# Altium schematic sheet LPCB219 - REMOTE ACCEL IF.SchDoc
size A3; Address1: Factory 10; Address2: 9-13 Dingley Avenue, Dandeong, VICTORIA 3175, AUSTRALIA; DocumentNumber: 7; Revision: 1; SheetNumber: 7; SheetTotal: 7; Lockie__PCB_SUB_ASSEMBLY: Remote Accel Interface; Lockie__PCB_ASSEMBLY: Main; Lockie__LDL: LPCB219; Lockie__PCB_DESCRIPTION: Control Node
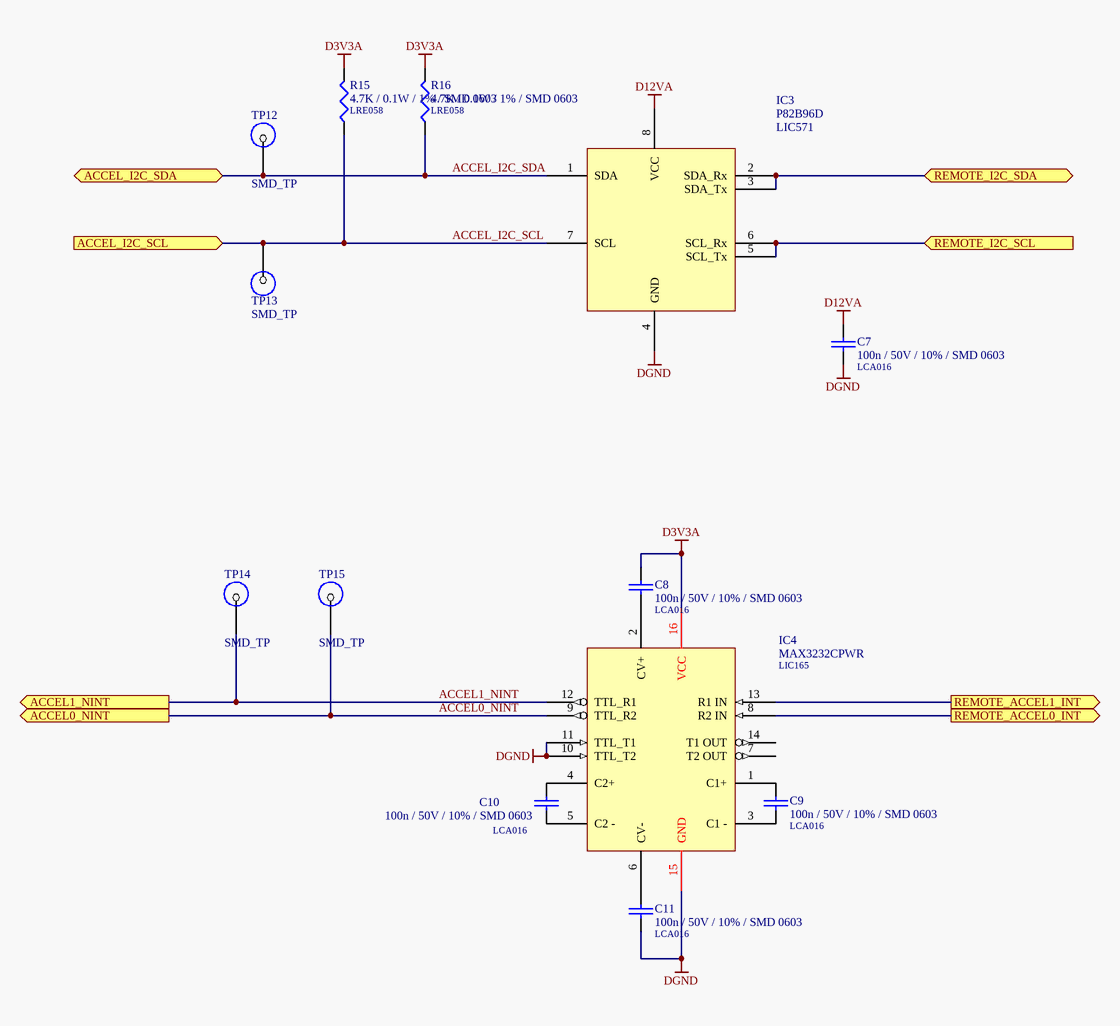
[diagram p0: LPCB219 - REMOTE ACCEL IF.SchDoc]

## Parts
C7  100n / 50V / 10% / SMD 0603  LDL_NUMBER: LCA016  [LFP011__CC1608-0603-IPC7351_B]
C8  100n / 50V / 10% / SMD 0603  LDL_NUMBER: LCA016  [LFP011__CC1608-0603-IPC7351_B]
C9  100n / 50V / 10% / SMD 0603  LDL_NUMBER: LCA016  [LFP011__CC1608-0603-IPC7351_B]
C10  100n / 50V / 10% / SMD 0603  LDL_NUMBER: LCA016  [LFP011__CC1608-0603-IPC7351_B]
C11  100n / 50V / 10% / SMD 0603  LDL_NUMBER: LCA016  [LFP011__CC1608-0603-IPC7351_B]
IC3  P82B96D  LDL_NUMBER: LIC571  [LFP097__SOIC150-8]
IC4  MAX3232CPWR  LDL_NUMBER: LIC165  [LFP049__TSSOP-16]
R15  4.7K / 0.1W / 1% / SMD 0603  LDL_NUMBER: LRE058  [LFP020__CR1608-0603-IPC7351_B]
R16  4.7K / 0.1W / 1% / SMD 0603  LDL_NUMBER: LRE058  [LFP020__CR1608-0603-IPC7351_B]
TP12  SMD_TP  [SMD-TP]  (no BOM)
TP13  SMD_TP  [SMD-TP]  (no BOM)
TP14  SMD_TP  [SMD-TP]  (no BOM)
TP15  SMD_TP  [SMD-TP]  (no BOM)

## Ports
ACCEL0_NINT (out), ACCEL1_NINT (out), ACCEL_I2C_SCL (in), ACCEL_I2C_SDA (bidir), REMOTE_ACCEL0_INT (out), REMOTE_ACCEL1_INT (out), REMOTE_I2C_SCL (in), REMOTE_I2C_SDA (bidir)

## Nets
D3V3A: C8.1 IC4.16(VCC) R15.2 R16.2
D12VA: C7.1 IC3.8(VCC)
DGND: C7.2 C11.2 IC3.4(GND) IC4.10(TTL_T2) IC4.11(TTL_T1) IC4.15(GND)
ACCEL0_NINT: IC4.9(TTL_R2) TP15.1 ; port ACCEL0_NINT
ACCEL1_NINT: IC4.12(TTL_R1) TP14.1 ; port ACCEL1_NINT
ACCEL_I2C_SCL: IC3.7(SCL) R15.1 TP13.1 ; port ACCEL_I2C_SCL
ACCEL_I2C_SDA: IC3.1(SDA) R16.1 TP12.1 ; port ACCEL_I2C_SDA
REMOTE_ACCEL0_INT: IC4.8(R2_IN) ; port REMOTE_ACCEL0_INT
REMOTE_ACCEL1_INT: IC4.13(R1_IN) ; port REMOTE_ACCEL1_INT
REMOTE_I2C_SCL: IC3.5(SCL_Tx) IC3.6(SCL_Rx) ; port REMOTE_I2C_SCL
REMOTE_I2C_SDA: IC3.2(SDA_Rx) IC3.3(SDA_Tx) ; port REMOTE_I2C_SDA
NetC8_2: C8.2 IC4.2(CV+)
NetC9_1: C9.1 IC4.1(C1+)
NetC9_2: C9.2 IC4.3(C1_-)
NetC10_1: C10.1 IC4.4(C2+)
NetC10_2: C10.2 IC4.5(C2_-)
NetC11_1: C11.1 IC4.6(CV-)

Not connected (* = marked no-connect by the designer): IC4 7(T2_OUT) 14(T1_OUT)

## Notes on the sheet
- PCB COMPONENT DESCRIPTION
- LDL NUMBER
- Assembly Details
- Size
- Drawing File Name
- Revision
- http://rloop.org
- Scale
- A3
- Sheet Details
- N.T.S
- Sheet:
- Of:

## Library data of the parts
C7 = 100n / 50V / 10% / SMD 0603: Capacitor, Ceramic Chip, 100nF (0.1uF), 50V, 5%, SMD 0603 [LCA016]; FMEDA__OPERATING__VOLTAGE_MIN: 0; FMEDA__OPERATING__VOLTAGE_MAX: 3.3; FMEDA__OPERATING__TEMP_MIN: -20; FMEDA__OPERATING__TEMP_TYP: 27; FMEDA__OPERATING__TEMP_MAX: 50; FMEDA__CHANNEL: COM; Value: 100n; FMEDA__FUNCTION_IN_SYSTEM: *; FMEDA__OPERATING__VOLTAGE_TYP: 3.3
C8-C11 = 100n / 50V / 10% / SMD 0603: Capacitor, Ceramic Chip, 100nF, 50V, 10%, SMD 0603; FMEDA__OPERATING__VOLTAGE_MIN: 0; FMEDA__OPERATING__VOLTAGE_MAX: 3.3; FMEDA__OPERATING__TEMP_MIN: -20; FMEDA__OPERATING__TEMP_TYP: 27; FMEDA__OPERATING__TEMP_MAX: 50; FMEDA__CHANNEL: COM; Value: 100n; FMEDA__FUNCTION_IN_SYSTEM: *; FMEDA__OPERATING__VOLTAGE_TYP: 3.3
IC3 = P82B96D: IC, I2C Line Driver [LIC571]
IC4 = MAX3232CPWR: IC, RS232 Line Driver, 3.3V, SMD TSSOP16; FMEDA__OPERATING__TEMP_MAX: 50; FMEDA__OPERATING__TEMP_MIN: -20; FMEDA__OPERATING__TEMP_TYP: 27; FMEDA__CHANNEL: COM; FMEDA__OPERATING__VOLTAGE_MAX: 3.3; FMEDA__OPERATING__VOLTAGE_MIN: 0; FMEDA__FUNCTION_IN_SYSTEM: *; FMEDA__OPERATING__VOLTAGE_TYP: 3.3
R15 R16 = 4.7K / 0.1W / 1% / SMD 0603: Resistor, Ceramic Chip, 4K7, 0.1W, 1%, SMD 0603 [LRE058]; FMEDA__OPERATING__POWER_MAX: 0; FMEDA__OPERATING__TEMP_MAX: 50; FMEDA__OPERATING__TEMP_MIN: -20; FMEDA__OPERATING__TEMP_TYP: 27; FMEDA__CHANNEL: COM; VALUE: 4.7K; FMEDA__OPERATING__POWER_MIN: 0; FMEDA__OPERATING__VOLTAGE_MAX: 0; FMEDA__OPERATING__VOLTAGE_MIN: 0; FMEDA__OPERATING__VOLTAGE_TYP: 0; FMEDA__FUNCTION_IN_SYSTEM: *
TP12-TP15 = SMD_TP: SMD Test Point; FMEDA__CHANNEL: COM; FMEDA__OPERATING__CURRENT_MAX: 0; FMEDA__OPERATING__TEMP_MAX: 50; FMEDA__OPERATING__TEMP_MIN: -20; FMEDA__OPERATING__TEMP_TYP: 27; FMEDA__OPERATING__VOLTAGE_MAX: 16; FMEDA__OPERATING__VOLTAGE_TYP: 12; FMEDA__OPERATING__CURRENT_MIN: 0; FMEDA__OPERATING__CURRENT_TYP: 0; FMEDA__OPERATING__VOLTAGE_MIN: 0